# EAGLE schematic big-one (EAGLE 6.6.0)
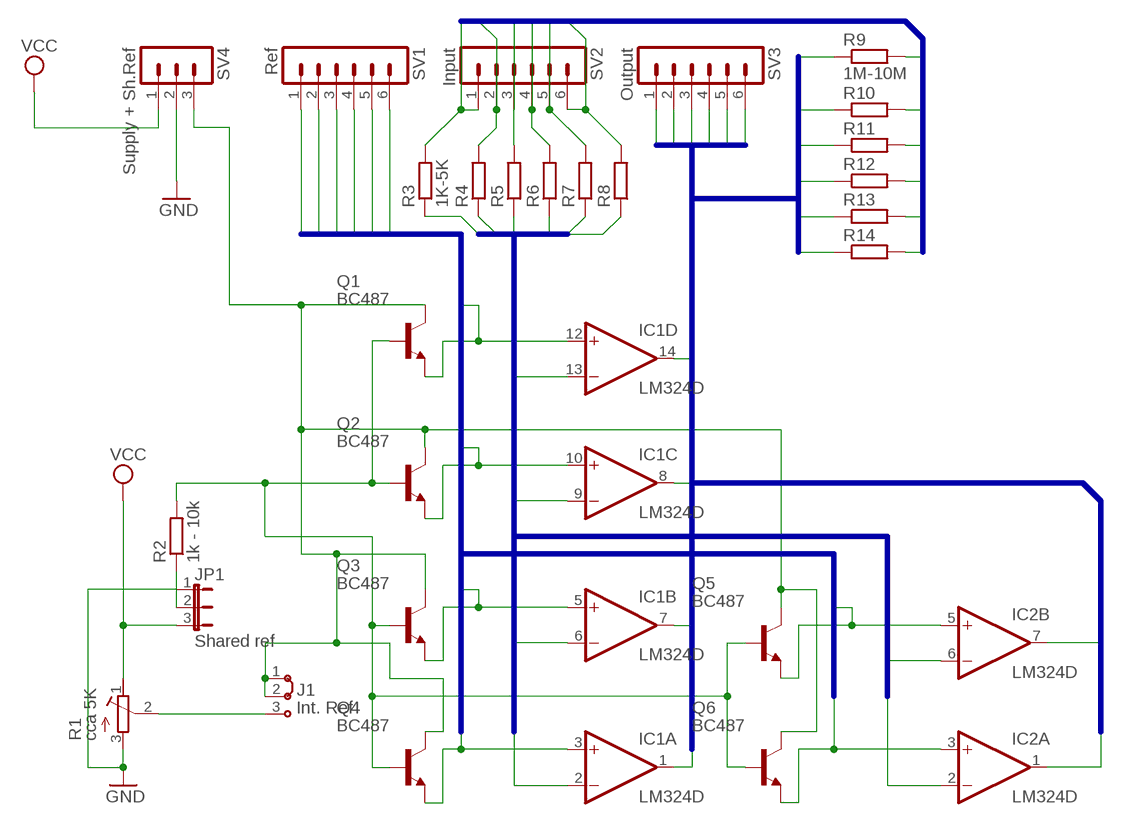
[diagram p0: schematic, sheet 1]

## Parts
IC1  LM324D  [SO14]
IC2  LM324D  [SO14]
J1  Int. Ref  J2X2MM  [04C]
JP1  Shared ref  JP2E  [JP2]
Q1  BC487  [TO92-EBC]
Q2  BC487  [TO92-EBC]
Q3  BC487  [TO92-EBC]
Q4  BC487  [TO92-EBC]
Q5  BC487  [TO92-EBC]
Q6  BC487  [TO92-EBC]
R1  cca 5K  R-TRIMMT93XB  [RTRIMT93XB]
R2  1k - 10k  R-EU_0204/5  [0204/5]
R3  1K-5K  R-EU_0204/5  [0204/5]
R4  R-EU_0204/5  [0204/5]
R5  R-EU_0204/5  [0204/5]
R6  R-EU_0204/5  [0204/5]
R7  R-EU_0204/5  [0204/5]
R8  R-EU_0204/5  [0204/5]
R9  1M-10M  R-EU_0204/5  [0204/5]
R10  R-EU_0204/5  [0204/5]
R11  R-EU_0204/5  [0204/5]
R12  R-EU_0204/5  [0204/5]
R13  R-EU_0204/5  [0204/5]
R14  R-EU_0204/5  [0204/5]
SV1  Ref  MA06-1  [MA06-1]
SV2  Input  MA06-1  [MA06-1]
SV3  Output  MA06-1  [MA06-1]
SV4  Supply + Sh.Ref  MA03-1  [MA03-1]

## Nets
DIB1: R3.2 R9.2 SV2.1
DIB2: R4.2 R10.2 SV2.2
DIB3: R5.2 R11.2 SV2.3
DIB4: R6.2 R12.2 SV2.4
DIB5: R7.2 R13.2 SV2.5
DIB6: R8.2 R14.2 SV2.6
GND: JP1.1 R1.3(E) SV4.2
IB1: IC1.13(D:-IN) R3.1
IB2: IC1.9(C:-IN) R4.1
IB3: IC1.6(B:-IN) R5.1
IB4: IC1.2(A:-IN) R6.1
IB5: IC2.6(B:-IN) R7.1
IB6: IC2.2(A:-IN) R8.1
N$1: Q1.B Q2.B Q3.B Q4.B Q5.B Q6.B R2.2
N$3: J1.3 R1.2(S)
N$11: JP1.2 R2.1
OB1: IC1.14(D:OUT) R9.1 SV3.1
OB2: IC1.8(C:OUT) R10.1 SV3.2
OB3: IC1.7(B:OUT) R11.1 SV3.3
OB4: IC1.1(A:OUT) R12.1 SV3.4
OB5: IC2.7(B:OUT) R13.1 SV3.5
OB6: IC2.1(A:OUT) R14.1 SV3.6
RFB1: IC1.12(D:+IN) Q1.E SV1.1
RFB2: IC1.10(C:+IN) Q2.E SV1.2
RFB3: IC1.5(B:+IN) Q3.E SV1.3
RFB4: IC1.3(A:+IN) Q4.E SV1.4
RFB5: IC2.5(B:+IN) Q5.E SV1.5
RFB6: IC2.3(A:+IN) Q6.E SV1.6
SH_SET: J1.1 J1.2 Q1.C Q2.C Q3.C Q4.C Q5.C Q6.C SV4.3
VCC: JP1.3 R1.1(A) SV4.1
Unconnected: IC2.8(C:OUT) IC2.9(C:-IN) IC2.10(C:+IN) IC2.12(D:+IN) IC2.13(D:-IN) IC2.14(D:OUT)

## Buses
RFB[1..6]
IB[1..6]
OB[1..6]
DIB[1..6]

## Power pins joined to a net without a drawn wire
V+: IC1.4(P:V+) IC2.4(P:V+)
V-: IC1.11(P:V-) IC2.11(P:V-)

## Library data of the parts
IC1 IC2 = linear:LM324: OP AMP
J1 = jumper:J2: Jumper switch 2 x 2.5 mm
JP1 = jumper:JP2E: JUMPER
Q1-Q6 = transistor-npn:BC487*: NPN Transistor
R1 = resistor:R-TRIMM: Trimm resistor
R2-R14 = resistor:R-EU_: RESISTOR, European symbol
SV1-SV3 = con-lstb:MA06-1: PIN HEADER; OC_FARNELL: unknown; OC_NEWARK: unknown
SV4 = con-lstb:MA03-1: PIN HEADER; OC_FARNELL: unknown; OC_NEWARK: unknown